# Altium project DSI_host_board.PrjPcb (part 2 of 2)

## Sheet hdmi_block.SchDoc
size A4; DrawnBy: ee; SheetTotal: HDMI Socket with ESD protection and level translator
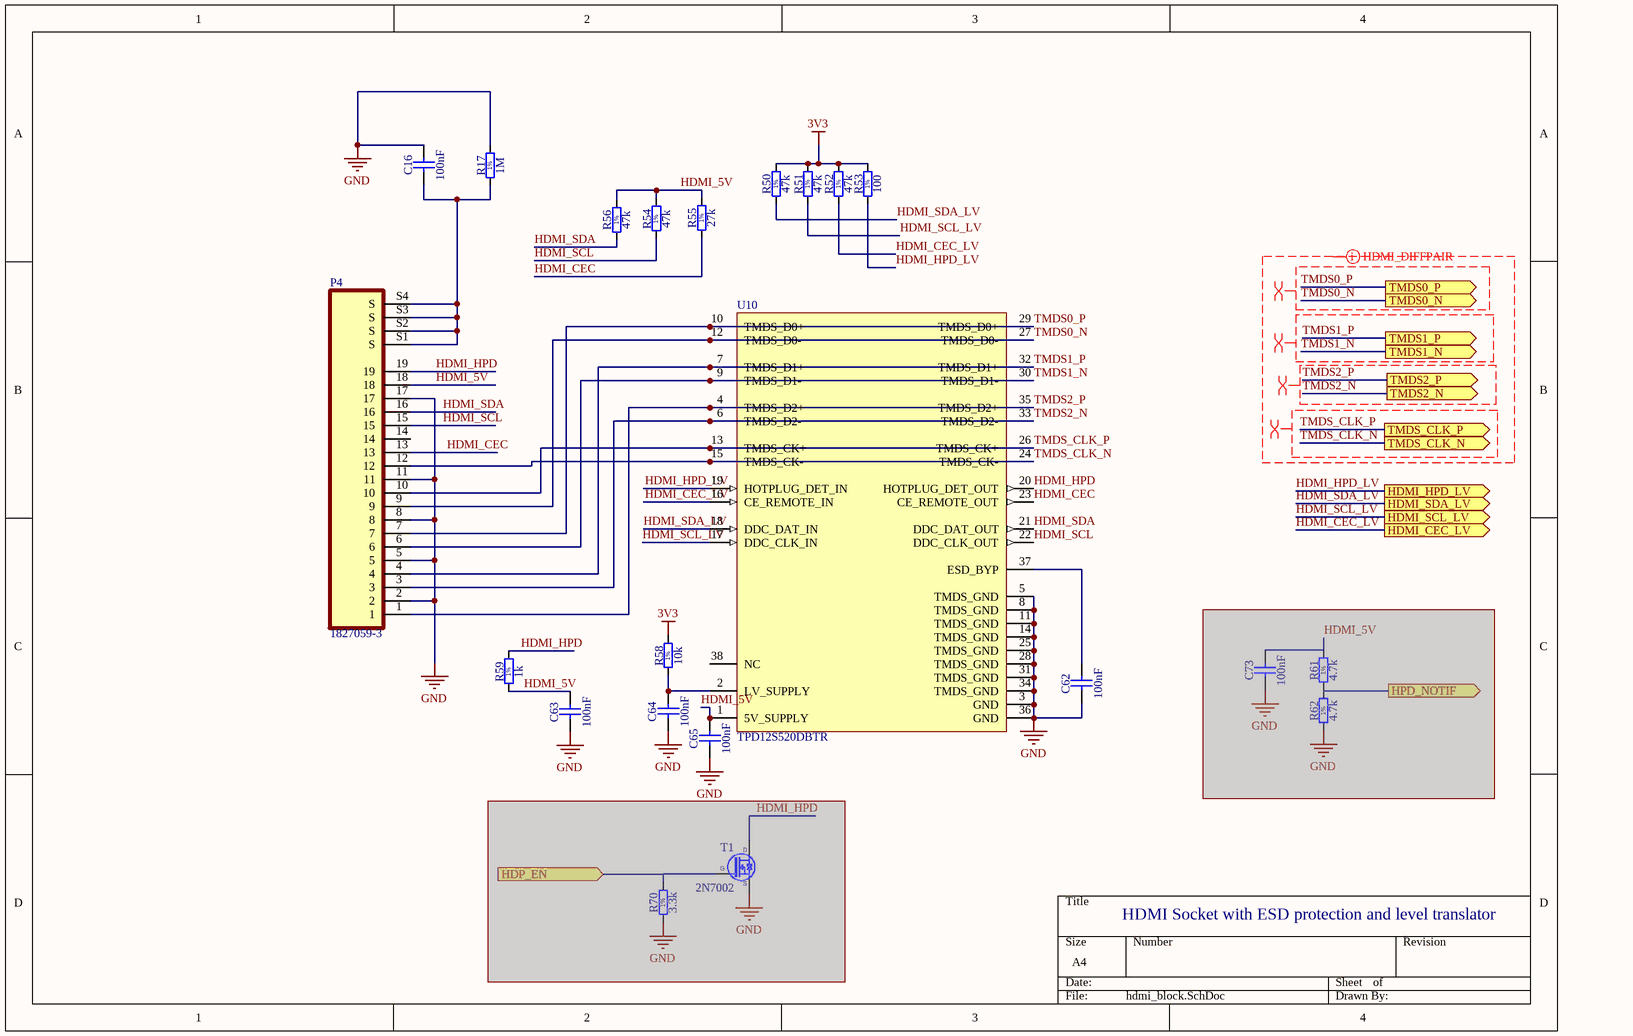
[diagram p3: hdmi_block.SchDoc]

### Parts
C16  100nF  [CAPC2013X100N]
C62  100nF  [CAPC2013X100N]
C63  100nF  [CAPC2013X100N]
C64  100nF  [CAPC2013X100N]
C65  100nF  [CAPC2013X100N]
C73  100nF  [CAPC2013X100N]  (masked out: inside a compile mask, not in the netlist)
P4  1827059-3  [TE_1827059-3]
R17  1M  [RESC1608X55N]
R50  47k  [RESC1608X55N]
R51  47k  [RESC1608X55N]
R52  47k  [RESC1608X55N]
R53  100  [RESC1608X55N]
R54  47k  [RESC1608X55N]
R55  27k  [RESC1608X55N]
R56  47k  [RESC1608X55N]
R58  10k  [RESC1608X55N]
R59  1k  [RESC1608X55N]
R61  4.7k  [RESC1608X55N]  (masked out: inside a compile mask, not in the netlist)
R62  4.7k  [RESC1608X55N]  (masked out: inside a compile mask, not in the netlist)
R70  3.3k  [RESC1608X55N]  (masked out: inside a compile mask, not in the netlist)
T1  2N7002  [SOT95P240X130-3N]  (masked out: inside a compile mask, not in the netlist)
U10  TPD12S520DBTR  [DBT38_L]

### Ports
HDMI_CEC_LV (out), HDMI_HPD_LV (out), HDMI_SCL_LV (out), HDMI_SDA_LV (out), HDP_EN (in), HPD_NOTIF (out), TMDS0_N (out), TMDS0_P (out), TMDS1_N (out), TMDS1_P (out), TMDS2_N (out), TMDS2_P (out), TMDS_CLK_N (out), TMDS_CLK_P (out)

### Nets
3V3: R50.2 R51.2 R52.2 R53.2 R58.2
GND: C16.2 C62.1 C63.1 C64.1 C65.1 P4.2 P4.5 P4.8 P4.11 P4.17 R17.2 U10.3(GND) U10.5(TMDS_GND) U10.8(TMDS_GND) U10.11(TMDS_GND) U10.14(TMDS_GND) U10.25(TMDS_GND) U10.28(TMDS_GND) U10.31(TMDS_GND) U10.34(TMDS_GND) U10.36(GND)
HDMI_5V: C63.2 C65.2 P4.18 R54.2 R55.2 R56.2 R59.1 U10.1(5V_SUPPLY)
HDMI_CEC: P4.13 R55.1 U10.23(CE_REMOTE_OUT)
HDMI_CEC_LV: R52.1 U10.16(CE_REMOTE_IN) ; port HDMI_CEC_LV
HDMI_HPD: P4.19 R59.2 U10.20(HOTPLUG_DET_OUT)
HDMI_HPD_LV: R53.1 U10.19(HOTPLUG_DET_IN) ; port HDMI_HPD_LV
HDMI_SCL: P4.15 R54.1 U10.22(DDC_CLK_OUT)
HDMI_SCL_LV: R51.1 U10.17(DDC_CLK_IN) ; port HDMI_SCL_LV
HDMI_SDA: P4.16 R56.1 U10.21(DDC_DAT_OUT)
HDMI_SDA_LV: R50.1 U10.18(DDC_DAT_IN) ; port HDMI_SDA_LV
TMDS0_N: P4.9 U10.12(TMDS_D0-) U10.27(TMDS_D0-) ; port TMDS0_N
TMDS0_P: P4.7 U10.10(TMDS_D0+) U10.29(TMDS_D0+) ; port TMDS0_P
TMDS1_N: P4.6 U10.9(TMDS_D1-) U10.30(TMDS_D1-) ; port TMDS1_N
TMDS1_P: P4.4 U10.7(TMDS_D1+) U10.32(TMDS_D1+) ; port TMDS1_P
TMDS2_N: P4.3 U10.6(TMDS_D2-) U10.33(TMDS_D2-) ; port TMDS2_N
TMDS2_P: P4.1 U10.4(TMDS_D2+) U10.35(TMDS_D2+) ; port TMDS2_P
TMDS_CLK_N: P4.12 U10.15(TMDS_CK-) U10.24(TMDS_CK-) ; port TMDS_CLK_N
TMDS_CLK_P: P4.10 U10.13(TMDS_CK+) U10.26(TMDS_CK+) ; port TMDS_CLK_P
NetC16_1: C16.1 P4.S1(S) P4.S2(S) P4.S3(S) P4.S4(S) R17.1
NetC62_2: C62.2 U10.37(ESD_BYP)
NetC64_2: C64.2 R58.1 U10.2(LV_SUPPLY)

Not connected (* = marked no-connect by the designer): P4 14; U10 38(NC)

### Layout directives
differential pair; net class HDMI_HS_LINES; rule Clearance Constraint [Clearance = 0.1mm]; rule Width Constraint [Pref Width = 0.1mm    Min Width = 0.1mm    Max Width = 0.2mm]; rule Differential Pairs Routing [Pref Gap = 0.1mm    Min Gap  = 0.1mm    Max Gap  = 0.25mmPref Width = 0.1mm    Min Width  = 0.1mm    Max Width  = 0.1mm]; rule Matched Net Lengths [Tolerance = 1mm]: TMDS0_N, TMDS0_P, TMDS1_N, TMDS1_P, TMDS2_N, TMDS2_P, TMDS_CLK_N, TMDS_CLK_P
rule Matched Net Lengths [Tolerance = 1mm]; net class TMDS0: TMDS0_N, TMDS0_P
rule Matched Net Lengths [Tolerance = 1mm]; net class TMDS1: TMDS1_N, TMDS1_P
rule Matched Net Lengths [Tolerance = 1mm]; net class TMDS2: TMDS2_N, TMDS2_P
rule Matched Net Lengths [Tolerance = 1mm]; net class TMDS3: TMDS_CLK_N, TMDS_CLK_P

### Notes on the sheet
- HDMI Socket with ESD protection and level translator
- (in symbol R0603_100K_1%_0.1W_100PPM) 1%

### Library data of the parts
C16 C62-C65 C73 = CC0805_1.5NF_50V_5%_C0G: Non-polarised capacitor; Part Description: SMD Multilayer Chip Ceramic Capacitor; Manufacturer: GENERIC; Manufacturer1 Part Number: C0805C152J5GACTU; Value: 1.5nF; Voltage: 50V; TC: C0G/NP0; Tolerance: ±5%; Part Number: CC0805_1.5NF_50V_5%_C0G; Component Kind: Standard; Component Type: Standard; Pin Count: 2; Status: Preferred; Manufacturer Part Number: CC0805_1.5NF_50V_5%_C0G; Case: 0805; Mounted: Yes; Socket: No; SMD: Yes; Sense: No; Manufacturer1 Example: KEMET; Manufacturer1 ComponentHeight: 1mm; HelpURL: \\cern.ch\dfs\Applications\Altium\Datasheets\CC0805_C0G_KEMET_(Commercial Grade).pdf; Author: CERN DEM BC; CreateDate: 18.11.2015; LatestRevisionDate: 18.11.2015
P4 = 1827059-3: EMBOSS PACKAGE HDMI CONN SMT NO-FLANGE T; MF: TE Connectivity; Availability: Unavailable; Value: *; TE_purchase_URL: https://www.te.com/usa-en/product-1827059-3.html?te_bu=Cor&te_type=disp&te_campaign=seda_glo_cor-seda-global-disp-prtnr-fy19-seda-model-bom-cta_sma-317_1&elqCampaignId=32493; Package: None; Price: None; SnapEDA_Link: https://www.snapeda.com/parts/1827059-3/TE%20Connectivity%20AMP%20Connectors/view-part/1316486/?ref=snap; MP: 1827059-3; EU_RoHS_Compliance: Compliant
R17 R50-R56 R58 R59 R61 R62 R70 = R0603_100K_1%_0.1W_100PPM: Resistor - 1%; Part Description: General Purpose Thick Film Chip Resistor; Manufacturer: GENERIC; Manufacturer1 Part Number: NRC06F1003TRF; Value: 100k; Power: 0.1W; TC: ±100ppm/°C; PressFit: No; Part Number: R0603_100K_1%_0.1W_100PPM; Component Kind: Standard; Component Type: Standard; Pin Count: 2; Status: Preferred; Tolerance: ±1%; Manufacturer Part Number: R0603_100K_1%_0.1W_100PPM; Case: 0603; Mounted: Yes; Sense: No; Socket: No; SMD: Yes; Manufacturer1 Example: NIC COMPONENT; Manufacturer1 ComponentHeight: 0.55mm; HelpURL: \\cern.ch\dfs\Applications\Altium\Datasheets\R0603_NIC_NRC.pdf; Author: CERN DEM JLC; CreateDate: 03.12.2007; LatestRevisionDate: 13.03.2008
T1 = 2N7002: N-CHANNEL MOSFET WITH DIODE; Part Description: 60V 280mA N-Channel Enhancement Mode Field Effect Transistor (FET); Manufacturer: FAIRCHILD SEMICONDUCTOR; PressFit: No; Bonding: No; Part Number: 2N7002; Component Kind: Standard; Component Type: Standard; Device: 2N7002; PackageDescription: SOT23 3-Leads, Pitch 0.95mm - Body 1.3x2.9mm, IPC Medium Density; Manufacturer Part Number: 2N7002; Pin Count: 3; Case: SOT23-3; Mounted: Yes; Socket: No; SMD: Yes; Sense: No; ComponentHeight: 1.3mm; HelpURL: \\cern.ch\dfs\Applications\Altium\Datasheets\2N7002.pdf; Author: CERN DEM JLC; CreateDate: 20.08.2008; LatestRevisionDate: 07.04.2009
U10 = TPD12S520DBTR: HDMI Receiver Port Protection and Interface Device, 12 Channels, -40 to +85 degC, 38-pin TSSOP (DBT), Green (RoHS & no Sb/Br); Manufacturer: Texas Instruments; Breakdown Voltage(Min)(V): 9; Differential Capacitance(pF): 0.05; IEC 61000-4-2 Contact(+/- kV): 8; IO Capacitance(Typ)(pF): 0.9; SubFamily: ESD Solution; DatasheetVersion: SLVS640C; PackageVersion: revI, Mar-2011; PackageReference: DBT38; PackageDescription: 38-Pin Plastic Small Outline 0.5 mm Pitch; Supplier 1: Digi-Key; Supplier Part Number 1: 296-23617-2-ND; Supplier 2: Digi-Key; Supplier Part Number 2: 296-23617-1-ND; Supplier 3: Digi-Key; Supplier Part Number 3: 296-23617-6-ND; Supplier 4: Newark; Supplier Part Number 4: 85M0176; Supplier 5: Mouser; Supplier Part Number 5: 595-TPD12S520DBTR; Eco-Plan: Green (RoHS & no Sb/Br); IO Leakage Current(nA): 0.05; Mounting Technology: Surface Mount; Code_JEDEC: MO-153; PartNumber: TPD12S520DBTR; ComponentLink1Description: Datasheet; ComponentLink1URL: http://www.ti.com/general/docs/lit/getliterature.tsp?genericPartNumber=TPD12S520&fileType=pdf; ComponentLink2Description: URL Link1; ComponentLink2URL: SamplesURL:http://www.ti.com/product/tpd12s520#samples

## Sheet adv_block.SchDoc
size A4
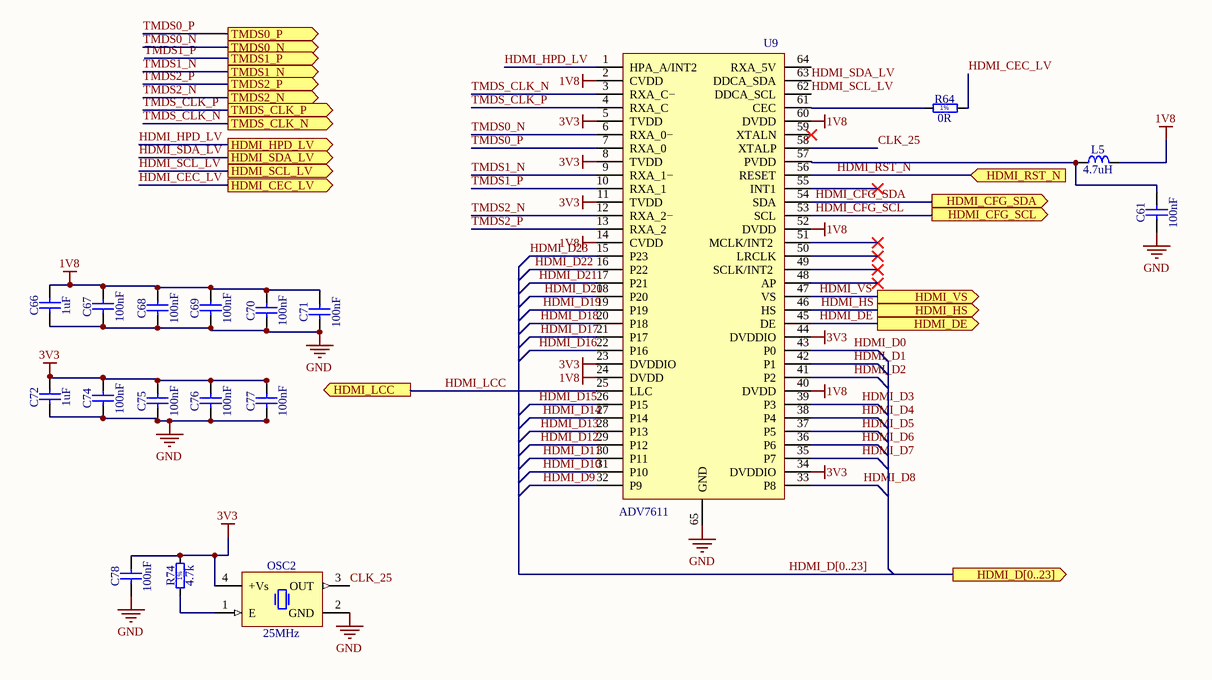
[diagram p4: adv_block.SchDoc]

### Parts
C61  100nF  [CAPC1005X55N]
C66  1uF  [CAPC1005X55N]
C67  100nF  [CAPC1005X55N]
C68  100nF  [CAPC1005X55N]
C69  100nF  [CAPC1005X55N]
C70  100nF  [CAPC1005X55N]
C71  100nF  [CAPC1005X55N]
C72  1uF  [CAPC1005X55N]
C74  100nF  [CAPC1005X55N]
C75  100nF  [CAPC1005X55N]
C76  100nF  [CAPC1005X55N]
C77  100nF  [CAPC1005X55N]
C78  100nF  [CAPC1005X55N]
L5  4.7uH  [IND_MURATA_BLM31PG]
OSC2  25MHz  [OSC_IQD_CFPS-69]
R64  0R  [RESC1005X40N]
R74  4.7k  [RESC1608X55N]
U9  ADV7611  [QFP50P1200X1200X120-65N-S415]

### Ports
HDMI_CEC_LV (out), HDMI_CFG_SCL (out), HDMI_CFG_SDA (out), HDMI_D[0..23] (out), HDMI_DE (out), HDMI_HPD_LV (out), HDMI_HS (out), HDMI_LCC (out), HDMI_RST_N (in), HDMI_SCL_LV (out), HDMI_SDA_LV (out), HDMI_VS (out), TMDS0_N (out), TMDS0_P (out), TMDS1_N (out), TMDS1_P (out), TMDS2_N (out), TMDS2_P (out), TMDS_CLK_N (out), TMDS_CLK_P (out)

### Nets
1V8: C66.2 C67.2 C68.2 C69.2 C70.2 C71.2 L5.2 U9.2(CVDD) U9.14(CVDD) U9.24(DVDD) U9.40(DVDD) U9.52(DVDD) U9.60(DVDD)
3V3: C72.2 C74.2 C75.2 C76.2 C77.2 C78.2 OSC2.4(+Vs) R74.2 U9.5(TVDD) U9.8(TVDD) U9.11(TVDD) U9.23(DVDDIO) U9.34(DVDDIO) U9.44(DVDDIO)
GND: C61.1 C66.1 C67.1 C68.1 C69.1 C70.1 C71.1 C72.1 C74.1 C75.1 C76.1 C77.1 C78.1 OSC2.2(GND) U9.65(GND)
CLK_25: OSC2.3(OUT) U9.58(XTALP)
HDMI_CEC_LV: R64.2 ; port HDMI_CEC_LV
HDMI_CFG_SCL: U9.53(SCL) ; port HDMI_CFG_SCL
HDMI_CFG_SDA: U9.54(SDA) ; port HDMI_CFG_SDA
HDMI_D0: U9.43(P0)
HDMI_D1: U9.42(P1)
HDMI_D2: U9.41(P2)
HDMI_D3: U9.39(P3)
HDMI_D4: U9.38(P4)
HDMI_D5: U9.37(P5)
HDMI_D6: U9.36(P6)
HDMI_D7: U9.35(P7)
HDMI_D8: U9.33(P8)
HDMI_D9: U9.32(P9)
HDMI_D10: U9.31(P10)
HDMI_D11: U9.30(P11)
HDMI_D12: U9.29(P12)
HDMI_D13: U9.28(P13)
HDMI_D14: U9.27(P14)
HDMI_D15: U9.26(P15)
HDMI_D16: U9.22(P16)
HDMI_D17: U9.21(P17)
HDMI_D18: U9.20(P18)
HDMI_D19: U9.19(P19)
HDMI_D20: U9.18(P20)
HDMI_D21: U9.17(P21)
HDMI_D22: U9.16(P22)
HDMI_D23: U9.15(P23)
HDMI_DE: U9.45(DE) ; port HDMI_DE
HDMI_HPD_LV: U9.1(HPA_A/INT2) ; port HDMI_HPD_LV
HDMI_HS: U9.46(HS) ; port HDMI_HS
HDMI_LCC: U9.25(LLC) ; port HDMI_LCC
HDMI_RST_N: U9.56(RESET) ; port HDMI_RST_N
HDMI_SCL_LV: U9.62(DDCA_SCL) ; port HDMI_SCL_LV
HDMI_SDA_LV: U9.63(DDCA_SDA) ; port HDMI_SDA_LV
HDMI_VS: U9.47(VS) ; port HDMI_VS
TMDS0_N: U9.6(RXA_0−) ; port TMDS0_N
TMDS0_P: U9.7(RXA_0) ; port TMDS0_P
TMDS1_N: U9.9(RXA_1−) ; port TMDS1_N
TMDS1_P: U9.10(RXA_1) ; port TMDS1_P
TMDS2_N: U9.12(RXA_2−) ; port TMDS2_N
TMDS2_P: U9.13(RXA_2) ; port TMDS2_P
TMDS_CLK_N: U9.3(RXA_C−) ; port TMDS_CLK_N
TMDS_CLK_P: U9.4(RXA_C) ; port TMDS_CLK_P
NetC61_2: C61.2 L5.1 U9.57(PVDD)
NetOSC2_1: OSC2.1(E) R74.1
NetR64_1: R64.1 U9.61(CEC)

Not connected (* = marked no-connect by the designer): U9 48(AP)* 49(SCLK/INT2_)* 50(LRCLK)* 51(MCLK/INT2_)* 55(INT1)* 59(XTALN)* 64(RXA_5V)

### Buses and harness runs
bus HDMI_D[0..23] = port HDMI_D[0..23]

### Notes on the sheet
- (in symbol R0402_10K_1%_0.0625W_100PPM) 1%
- (in symbol R0603_100K_1%_0.1W_100PPM) 1%

### Library data of the parts
C61 C67-C71 C74-C78 = CC0402_100NF_16V_10%_X5R: Non-polarised capacitor; Part Description: SMD Multilayer Chip Ceramic Capacitor; Manufacturer: GENERIC; Manufacturer1 Part Number: GRM155R61C104KA88D; Voltage: 16V; TC: X5R; Tolerance: ±10%; Part Number: CC0402_100NF_16V_10%_X5R; Component Kind: Standard; Component Type: Standard; Pin Count: 2; Value: 100nF; Status: None; Manufacturer Part Number: CC0402_100NF_16V_10%_X5R; Case: 0402; Mounted: Yes; Socket: No; SMD: Yes; Sense: No; Manufacturer1 Example: MURATA; Manufacturer1 ComponentHeight: 0.55mm; HelpURL: \\cern.ch\dfs\Applications\Altium\Datasheets\CC0402_X5R_MURATA_GRM.pdf; Author: CERN DEM JLC; CreateDate: 10.12.2013; LatestRevisionDate: 10.12.2013
C66 C72 = CC0402_100NF_16V_10%_X5R: Non-polarised capacitor; Part Description: SMD Multilayer Chip Ceramic Capacitor; Manufacturer: GENERIC; Manufacturer1 Part Number: GRM155R61C104KA88D; Value: 100nF; Voltage: 16V; TC: X5R; Tolerance: ±10%; Part Number: CC0402_100NF_16V_10%_X5R; Component Kind: Standard; Component Type: Standard; Pin Count: 2; Status: None; Manufacturer Part Number: CC0402_100NF_16V_10%_X5R; Case: 0402; Mounted: Yes; Socket: No; SMD: Yes; Sense: No; Manufacturer1 Example: MURATA; Manufacturer1 ComponentHeight: 0.55mm; HelpURL: \\cern.ch\dfs\Applications\Altium\Datasheets\CC0402_X5R_MURATA_GRM.pdf; Author: CERN DEM JLC; CreateDate: 10.12.2013; LatestRevisionDate: 10.12.2013
L5 = IND1206_MURATA_BLM31PG500SN1: Inductor; Part Description: SMD EMIFIL Chip Ferrite Bead; Manufacturer: MURATA; Value: 50R@100MHz; Power: 3.5A; Resistance: 0.015R; Part Number: IND1206_MURATA_BLM31PG500SN1; Component Kind: Standard; Component Type: Standard; Pin Count: 2; Status: None; Manufacturer Part Number: BLM31PG500SN1; Case: 1206; Mounted: Yes; Socket: No; SMD: Yes; Sense: No; ComponentHeight: 1.3mm; HelpURL: \\cern.ch\dfs\Applications\Altium\Datasheets\IND1206_MURATA_BLM31P.pdf; Author: CERN DEM JLC; CreateDate: 05.12.2013; LatestRevisionDate: 05.12.2013
OSC2 = OSC_50MHZ_IQD_LFSPXO009592: Oscillator 4 pins 1=E 2=GND 3=OUT 4=+Vs; Part Description: 3.3V, ±50ppm,  -40..85°C, CMOS Surface Mount Clock Oscillator, Low Current (CFPS-69 Series); Manufacturer: IQD FREQUENCY PRODUCTS; Value: 50MHz; PressFit: No; Bonding: No; Part Number: OSC_50MHZ_IQD_LFSPXO009592; Component Kind: Standard; Component Type: Standard; PackageDescription: Oscillator, Side Concave, 2.54mm Pitch, 4 Pins, 3.20mm L X 5.00mm W X 1.00mm H, CFPS-69 Series; Manufacturer Part Number: LFSPXO009592; Pin Count: 4; Mounted: Yes; Socket: No; SMD: Yes; Sense: No; ComponentHeight: 0.95mm; HelpURL: \\cern.ch\dfs\Applications\Altium\Datasheets\OSC_IQD_LFSPXO009592.pdf; Author: CERN DEM JLC; CreateDate: 16.03.2010; LatestRevisionDate: 07.11.2016
R64 = R0402_10K_1%_0.0625W_100PPM: Resistor - 1%; Part Description: General Purpose Thick Film Chip Resistor; Manufacturer: GENERIC; Manufacturer1 Part Number: 232270671003L; Value: 10k; TC: ±100ppm/°C; PressFit: No; Part Number: R0402_10K_1%_0.0625W_100PPM; Component Kind: Standard; Component Type: Standard; Pin Count: 2; Status: Not Recommended; Power: 0.0625W; Tolerance: ±1%; Manufacturer Part Number: R0402_10K_1%_0.0625W_100PPM; Case: 0402; Mounted: Yes; Sense: No; Socket: No; SMD: Yes; Manufacturer1 Example: YAGEO PHYCOMP; Manufacturer1 ComponentHeight: 0.4mm; HelpURL: \\cern.ch\dfs\Applications\Altium\Datasheets\R0402_Phycomp_RC0402.pdf; Author: CERN DEM JLC; CreateDate: 03.12.2007; LatestRevisionDate: 17.10.2012
R74 = R0603_100K_1%_0.1W_100PPM: as R17 on sheet hdmi_block; Part Number: R0603_100K_1%_0.1W_100PPM; Component Kind: Standard; Component Type: Standard; Pin Count: 2; Status: Preferred; Tolerance: ±1%; Manufacturer Part Number: R0603_100K_1%_0.1W_100PPM; Case: 0603; Mounted: Yes; Sense: No; Socket: No; SMD: Yes; Manufacturer1 Example: NIC COMPONENT; Manufacturer1 ComponentHeight: 0.55mm; HelpURL: \\cern.ch\dfs\Applications\Altium\Datasheets\R0603_NIC_NRC.pdf; Author: CERN DEM JLC; CreateDate: 03.12.2007; LatestRevisionDate: 13.03.2008
U9 = ADV7611: Low Power 165 MHz HDMI Receiver

## Nets that join several sheets
1V2: fpga_block (12 pins), power_block (1V2.1 C4.2 R18.1 U.20)
1V5: fpga_block (8 pins), power_block (1V5.1 C79.2 R20.1 U.23)
1V8: fpga_block (10 pins), power_block (7 pins), adv_block (13 pins)
3V3: fpga_block (46 pins), power_block (13 pins), uartjtag_block (R15.1 R16.2), hdmi_block (5 pins), adv_block (14 pins)
5V_IN: fpga_block (P2.11), power_block (14 pins), uartjtag_block (D1.1)
GND: fpga_block (69 pins), power_block (35 pins), uartjtag_block (13 pins), hdmi_block (21 pins), adv_block (15 pins)
HDMI_CEC_LV: hdmi_block (R52.1 U10.16), adv_block (R64.2)
HDMI_CFG_SCL: fpga_block (R47.1 U1.C13 U8.1), adv_block (U9.53)
HDMI_CFG_SDA: fpga_block (R48.1 U1.A13 U8.3), adv_block (U9.54)
HDMI_D0: fpga_block (U1.E11), adv_block (U9.43)
HDMI_D1: fpga_block (U1.E10), adv_block (U9.42)
HDMI_D2: fpga_block (U1.A10), adv_block (U9.41)
HDMI_D3: fpga_block (U1.B10), adv_block (U9.39)
HDMI_D4: fpga_block (U1.E8), adv_block (U9.38)
HDMI_D5: fpga_block (U1.A9), adv_block (U9.37)
HDMI_D6: fpga_block (U1.C9), adv_block (U9.36)
HDMI_D7: fpga_block (U1.D9), adv_block (U9.35)
HDMI_D8: fpga_block (U1.A8), adv_block (U9.33)
HDMI_D9: fpga_block (U1.B8), adv_block (U9.32)
HDMI_D10: fpga_block (U1.C8), adv_block (U9.31)
HDMI_D11: fpga_block (U1.A7), adv_block (U9.30)
HDMI_D12: fpga_block (U1.C7), adv_block (U9.29)
HDMI_D13: fpga_block (U1.E6), adv_block (U9.28)
HDMI_D14: fpga_block (U1.A6), adv_block (U9.27)
HDMI_D15: fpga_block (U1.B6), adv_block (U9.26)
HDMI_D16: fpga_block (U1.C6), adv_block (U9.22)
HDMI_D17: fpga_block (U1.A5), adv_block (U9.21)
HDMI_D18: fpga_block (U1.C5), adv_block (U9.20)
HDMI_D19: fpga_block (U1.D5), adv_block (U9.19)
HDMI_D20: fpga_block (U1.D6), adv_block (U9.18)
HDMI_D21: fpga_block (U1.F7), adv_block (U9.17)
HDMI_D22: fpga_block (U1.D8), adv_block (U9.16)
HDMI_D23: fpga_block (U1.E7), adv_block (U9.15)
HDMI_DE: fpga_block (U1.A11), adv_block (U9.45)
HDMI_HPD_LV: hdmi_block (R53.1 U10.19), adv_block (U9.1)
HDMI_HS: fpga_block (U1.C11), adv_block (U9.46)
HDMI_LCC: fpga_block (U1.C10), adv_block (U9.25)
HDMI_RST_N: fpga_block (U1.A12), adv_block (U9.56)
HDMI_SCL_LV: hdmi_block (R51.1 U10.17), adv_block (U9.62)
HDMI_SDA_LV: hdmi_block (R50.1 U10.18), adv_block (U9.63)
HDMI_VS: fpga_block (U1.B12), adv_block (U9.47)
LCD_PWREN: fpga_block (U1.A14), power_block (R29.2 U5.4)
NetU1_D11: fpga_block (U1.D11), power_block (U6.4)
RST_CPU: fpga_block (R39.2), uartjtag_block (U4.23)
TCK: fpga_block (P1.3 R37.1 U1.C14), uartjtag_block (R86.2)
TDI: fpga_block (P1.5 U1.C12), uartjtag_block (R85.2)
TDO: fpga_block (P1.4 U1.E14), uartjtag_block (R84.2)
TMDS0_N: hdmi_block (P4.9 U10.12 U10.27), adv_block (U9.6)
TMDS0_P: hdmi_block (P4.7 U10.10 U10.29), adv_block (U9.7)
TMDS1_N: hdmi_block (P4.6 U10.9 U10.30), adv_block (U9.9)
TMDS1_P: hdmi_block (P4.4 U10.7 U10.32), adv_block (U9.10)
TMDS2_N: hdmi_block (P4.3 U10.6 U10.33), adv_block (U9.12)
TMDS2_P: hdmi_block (P4.1 U10.4 U10.35), adv_block (U9.13)
TMDS_CLK_N: hdmi_block (P4.12 U10.15 U10.24), adv_block (U9.3)
TMDS_CLK_P: hdmi_block (P4.10 U10.13 U10.26), adv_block (U9.4)
TMS: fpga_block (P1.6 U1.A15), uartjtag_block (R87.2)
UART_RX: fpga_block (U1.F9), uartjtag_block (LD9.2 U4.24)
UART_TX: fpga_block (U1.F10), uartjtag_block (LD8.2 U4.25)